# Altium schematic sheet 48V_Converter.SchDoc
size A; SheetNumber: 8; SheetTotal: 9
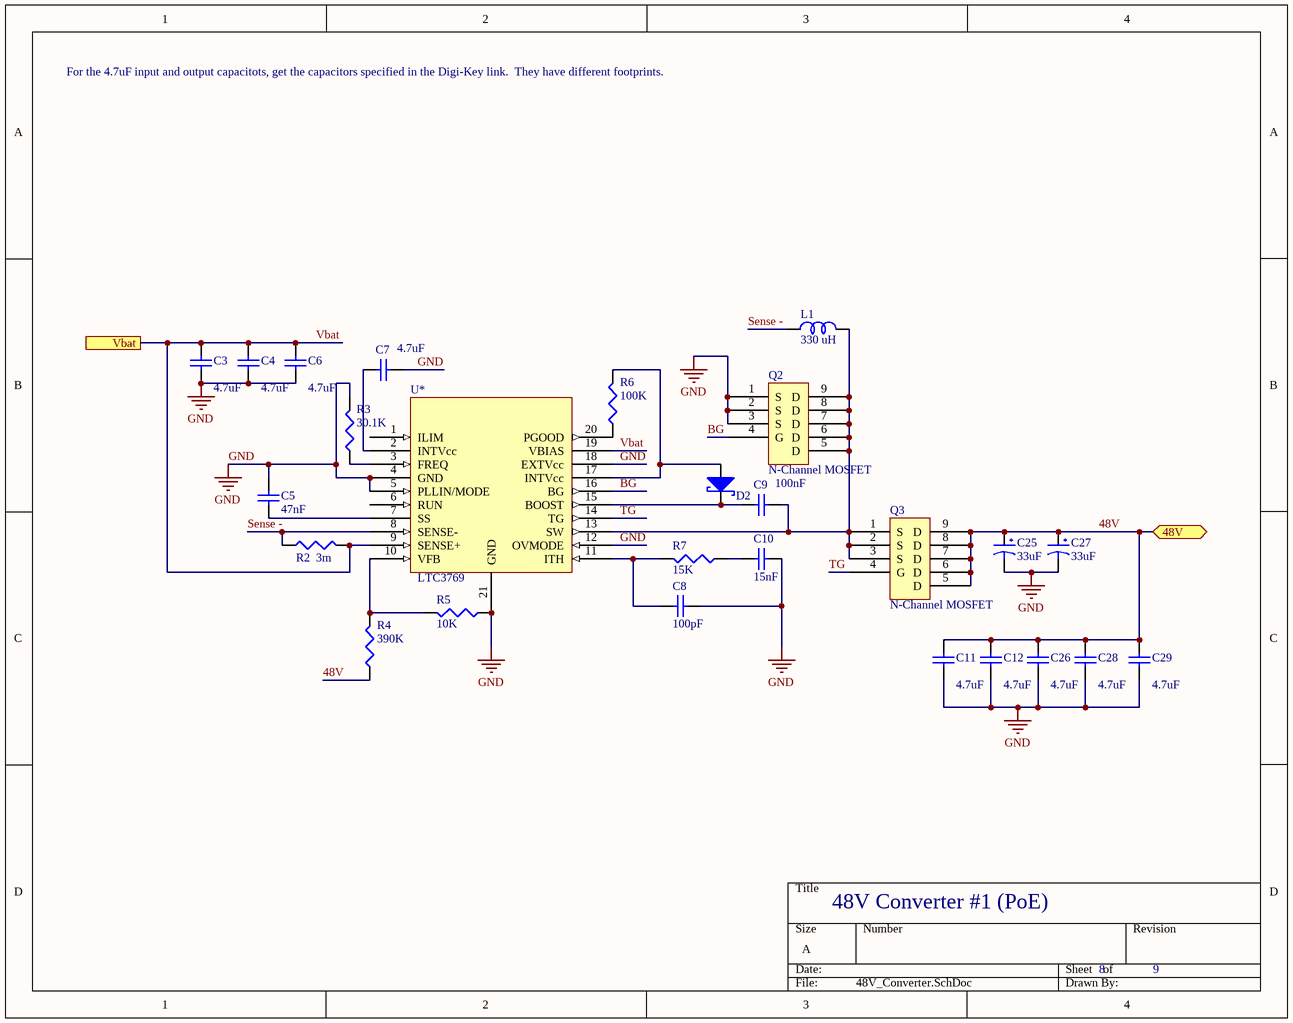
[diagram p0: 48V_Converter.SchDoc]

## Parts
C3  value 4.7uF  [C1210]  (hidden comment: HMK325C7475KN-TE)
C4  value 4.7uF  [C1210]  (hidden comment: HMK325C7475KN-TE)
C5  value 47nF  [C1206]  (hidden comment: Cap Semi)
C6  value 4.7uF  [C1210]  (hidden comment: HMK325C7475KN-TE)
C7  value 4.7uF  [C1206]  (hidden comment: Cap Semi)
C8  value 100pF  [C1206]  (hidden comment: Cap Semi)
C9  value 100nF  [C1206]  (hidden comment: Cap Semi)
C10  value 15nF  [C1206]  (hidden comment: Cap Semi)
C11  value 4.7uF  [C1210]  (hidden comment: HMK325C7475KN-TE)
C12  value 4.7uF  [C1210]  (hidden comment: HMK325C7475KN-TE)
C25  33uF  [UUX1J330MNL6GS]
C26  value 4.7uF  [C1210]  (hidden comment: HMK325C7475KN-TE)
C27  33uF  [UUX1J330MNL6GS]
C28  value 4.7uF  [C1210]  (hidden comment: HMK325C7475KN-TE)
C29  value 4.7uF  [C1210]  (hidden comment: HMK325C7475KN-TE)
D2  SCHOTTKY  [BAS170W]  (value not drawn)
L1  330 uH  [PQ2617BHA-330K]
Q2  N-Channel MOSFET  [BSC028N06LS3]
Q3  N-Channel MOSFET  [BSC028N06LS3]
R2  value 3m  [J1-0603]  (hidden comment: Res3)
R3  value 30.1K  [J1-0603]  (hidden comment: Res3)
R4  value 390K  [J1-0603]  (hidden comment: Res3)
R5  value 10K  [J1-0603]  (hidden comment: Res3)
R6  value 100K  [J1-0603]  (hidden comment: Res3)
R7  value 15K  [J1-0603]  (hidden comment: Res3)
U*  LTC3769  [LTC3769]

## Ports
48V (bidir), Vbat

## Nets
GND: C3.1 C4.1 C5.2 C6.1 C7.1 C8.1 C10.1 C11.1 C12.1 C25.2 C26.1 C27.2 C28.1 C29.1 Q2.1(S) Q2.2(S) Q2.3(S) R3.2 R5.1 U*.4(GND) U*.5(PLLIN/MODE) U*.12(OVMODE) U*.18(EXTVcc) U*.21(GND)
48V: C11.2 C12.2 C25.1 C26.2 C27.1 C28.2 C29.2 Q3.5(D) Q3.6(D) Q3.7(D) Q3.8(D) Q3.9(D) R4.1 ; port 48V
BG: Q2.4(G) U*.16(BG)
Sense -: L1.2 R2.1 U*.8(SENSE-)
TG: Q3.4(G) U*.14(TG)
Vbat: C3.2 C4.2 C6.2 R2.2 U*.9(SENSE+) U*.19(VBIAS) ; port Vbat
NetC5_1: C5.1 U*.7(SS)
NetC7_2: C7.2 U*.2(INTVcc)
NetC8_2: C8.2 R7.2 U*.11(ITH)
NetC9_1: C9.1 L1.1 Q2.5(D) Q2.6(D) Q2.7(D) Q2.8(D) Q2.9(D) Q3.1(S) Q3.2(S) Q3.3(S) U*.13(SW)
NetC9_2: C9.2 D2.K(Cathode) U*.15(BOOST)
NetC10_2: C10.2 R7.1
NetD2_A: D2.A(Anode) R6.2 U*.17(INTVcc)
NetR3_1: R3.1 U*.3(FREQ)
NetR4_2: R4.2 R5.2 U*.10(VFB)
NetR6_1: R6.1 U*.20(PGOOD)

Not connected (* = marked no-connect by the designer): U* 1(ILIM) 6(RUN)

## Notes on the sheet
- For the 4.7uF input and output capacitots, get the capacitors specified in the Digi-Key link.  They have different footprints.
- 48V Converter #1 (PoE)

## Library data of the parts
C3-C12 C26 C28 C29 = Cap Semi: Capacitor (Semiconductor SIM Model); Published: 8-Jun-2000; LatestRevisionDate: 29-May-2009; LatestRevisionNote: IPC-7351 Footprint Added.; PackageReference: C1206; Publisher: Altium Limited; PackageDescription: Chip Capacitor
  C3 C4 C6 C11 C12 C26 C28 C29: ComponentLink1Description: Datasheet; ComponentLink1URL: https://www.yuden.co.jp/productdata/catalog/mlcc06_e.pdf; ComponentLink2Description: Digi-Key; ComponentLink2URL: https://www.digikey.com/product-detail/en/taiyo-yuden/HMK325C7475KN-TE/587-5038-1-ND/6563881
C25 C27 = UUX1J330MNL6GS: CAP ALUM 33UF 20% 63V SMD; Digikey: https://www.digikey.com/product-detail/en/nichicon/UWX1C100MCL2GB/493-2099-1-ND/590074; Datasheet: http://nichicon-us.com/english/products/pdfs/e-uwx.pdf; ComponentLink1Description: Digi-Key; ComponentLink1URL: https://www.digikey.com/product-detail/en/nichicon/UUX1J330MNL6GS/493-9972-1-ND/3974043; ComponentLink2Description: Datasheet; ComponentLink2URL: https://www.nichicon.co.jp/english/products/pdfs/e-uux.pdf
D2 = BAS170W: DIODE SCHOTTKY 70V 70MA SOD323-2; ComponentLink1Description: Digi-Key; ComponentLink1URL: https://www.digikey.com/product-detail/en/infineon-technologies/BAS170WE6327HTSA1/BAS170WE6327HTSA1CT-ND/3819495; ComponentLink2Description: Datasheet; ComponentLink2URL: https://www.infineon.com/dgdl/Infineon-BAS70series-DataSheet-v01_00-EN.pdf?fileId=5546d4626d66c2b1016d73f7ecf220d6&redirId=117942
L1 = PQ2617BHA-330K: 33µH Shielded Wirewound Inductor 28A 2.5mOhm Max Nonstandard; ComponentLink1Description: Datasheet; ComponentLink1URL: https://www.bourns.com/docs/Product-Datasheets/PQ2617.pdf; ComponentLink2Description: Digi-Key; ComponentLink2URL: https://www.digikey.com/product-detail/en/bourns-inc/PQ2617BHA-330K/PQ2617BHA-330K-ND/7695918
Q2 Q3 = BSC028N06LS3: ComponentLink1Description: Datasheet; ComponentLink1URL: https://www.mouser.com/datasheet/2/196/Infineon-BSC028N06LS3-DS-v02_02-en-1226498.pdf
R2-R7 = Res3: Resistor; Published: 8-Jun-2000; LatestRevisionDate: 29-May-2009; LatestRevisionNote: IPC-7351 Footprint Added.; PackageReference: J1-0603; Publisher: Altium Limited; PackageDescription: Chip Resistor
U* = LTC3769: 48V Switching converter; ComponentLink1Description: Analog Devices; ComponentLink1URL: https://www.analog.com/en/products/ltc3769.html#; ComponentLink2Description: Datasheet; ComponentLink2URL: https://www.analog.com/media/en/technical-documentation/data-sheets/3769fa.pdf